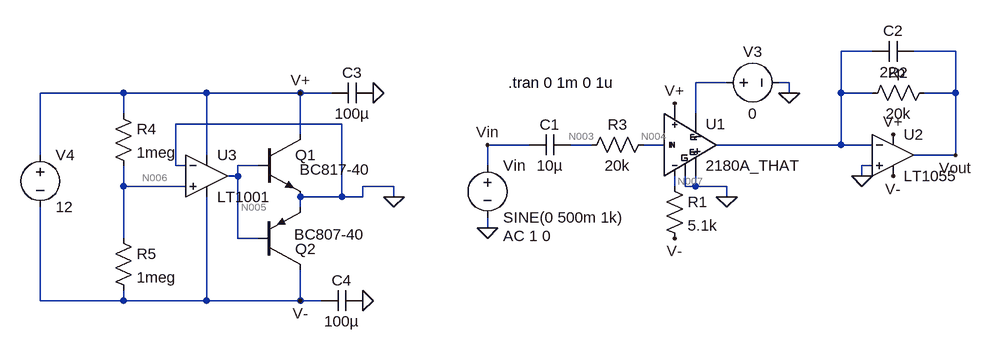
[diagram p0: schematic take2180.asc]
take2180.asc, the LTspice schematic file:
Version 4
SHEET 1 880 680
WIRE 448 48 400 48
WIRE 576 48 512 48
WIRE 224 96 176 96
WIRE 320 96 304 96
WIRE -704 112 -832 112
WIRE -576 112 -704 112
WIRE -432 112 -576 112
WIRE -384 112 -432 112
WIRE 320 112 320 96
WIRE 400 112 400 48
WIRE 448 112 400 112
WIRE 576 112 576 48
WIRE 576 112 528 112
WIRE -704 144 -704 112
WIRE 176 144 176 96
WIRE -368 160 -624 160
WIRE -432 176 -432 112
WIRE -80 192 -144 192
WIRE 16 192 -16 192
WIRE 128 192 96 192
WIRE 400 192 400 112
WIRE 400 192 208 192
WIRE 448 192 400 192
WIRE -832 208 -832 112
WIRE -576 208 -576 112
WIRE 576 208 576 112
WIRE 576 208 512 208
WIRE -624 224 -624 160
WIRE -608 224 -624 224
WIRE -496 224 -528 224
WIRE -144 224 -144 192
WIRE 448 224 432 224
WIRE -528 240 -528 224
WIRE -528 240 -544 240
WIRE 432 240 432 224
WIRE -704 256 -704 224
WIRE -608 256 -704 256
WIRE -288 256 -336 256
WIRE 144 256 144 240
WIRE 160 256 160 240
WIRE 176 256 176 240
WIRE 176 256 160 256
WIRE 224 256 176 256
WIRE -368 272 -368 160
WIRE -368 272 -432 272
WIRE -336 272 -336 256
WIRE -336 272 -368 272
WIRE -288 272 -288 256
WIRE 224 272 224 256
WIRE -432 288 -432 272
WIRE -144 320 -144 304
WIRE -704 336 -704 256
WIRE -528 336 -528 240
WIRE -496 336 -528 336
WIRE -832 432 -832 288
WIRE -704 432 -704 416
WIRE -704 432 -832 432
WIRE -576 432 -576 272
WIRE -576 432 -704 432
WIRE -432 432 -432 384
WIRE -432 432 -576 432
WIRE -400 432 -432 432
FLAG -432 112 V+
FLAG -432 432 V-
FLAG 144 128 V+
FLAG 144 336 V-
FLAG 224 272 0
FLAG 320 112 0
FLAG -144 320 0
FLAG 432 240 0
FLAG 480 176 V+
FLAG 480 240 V-
FLAG -288 272 0
FLAG -336 432 0
FLAG -320 112 0
FLAG -144 192 Vin
FLAG 576 208 Vout
SYMBOL myLib\\THAT2180 160 192 R0
SYMATTR InstName U1
SYMBOL res 128 240 R0
SYMATTR InstName R1
SYMATTR Value 5.1k
SYMBOL voltage 208 96 R270
WINDOW 0 32 56 VTop 2
WINDOW 3 -32 56 VBottom 2
WINDOW 123 0 0 Left 2
WINDOW 39 0 0 Left 2
SYMATTR InstName V3
SYMATTR Value 0
SYMBOL voltage -144 208 R0
WINDOW 123 24 124 Left 2
WINDOW 39 0 0 Left 2
SYMATTR Value2 AC 1 0
SYMATTR InstName Vin
SYMATTR Value SINE(0 500m 1k)
SYMBOL cap -80 208 R270
WINDOW 0 32 32 VTop 2
WINDOW 3 0 32 VBottom 2
SYMATTR InstName C1
SYMATTR Value 10µ
SYMBOL res 0 208 R270
WINDOW 0 32 56 VTop 2
WINDOW 3 0 56 VBottom 2
SYMATTR InstName R3
SYMATTR Value 20k
SYMBOL Opamps\\LT1055 480 144 R0
SYMATTR InstName U2
SYMBOL res 432 128 R270
WINDOW 0 32 56 VTop 2
WINDOW 3 0 56 VBottom 2
SYMATTR InstName R2
SYMATTR Value 20k
SYMBOL cap 448 64 R270
WINDOW 0 32 32 VTop 2
WINDOW 3 0 32 VBottom 2
SYMATTR InstName C2
SYMATTR Value 22p
SYMBOL voltage -832 192 R0
WINDOW 123 0 0 Left 2
WINDOW 39 0 0 Left 2
SYMATTR InstName V4
SYMATTR Value 12
SYMBOL res -720 128 R0
SYMATTR InstName R4
SYMATTR Value 1meg
SYMBOL res -720 320 R0
SYMATTR InstName R5
SYMATTR Value 1meg
SYMBOL npn -496 176 R0
WINDOW 3 63 54 Left 2
SYMATTR Value BC817-40
SYMATTR InstName Q1
SYMBOL pnp -496 384 M180
WINDOW 3 55 54 Left 2
SYMATTR Value BC807-40
SYMATTR InstName Q2
SYMBOL cap -320 96 R90
WINDOW 0 0 32 VBottom 2
WINDOW 3 32 32 VTop 2
SYMATTR InstName C3
SYMATTR Value 100µ
SYMATTR SpiceLine Rser=2
SYMBOL cap -336 416 R90
WINDOW 0 0 32 VBottom 2
WINDOW 3 32 32 VTop 2
SYMATTR InstName C4
SYMATTR Value 100µ
SYMATTR SpiceLine Rser=2
SYMBOL Opamps\\LT1001 -576 176 R0
SYMATTR InstName U3
TEXT -112 96 Left 2 !.tran 0 1m 0 1u

The netlist it stands for:
* take2180.asc
XU1 N004 0 N002 N007 0 V+ N001 2180A_THAT  ; pins In EC+ EC- V- GND V+ OUT
R1 N007 V- 5.1k
V3 N002 0 0
Vin Vin 0 SINE(0 500m 1k) AC 1 0
C1 Vin N003 10µ
R3 N003 N004 20k
XU2 0 N001 V+ V- Vout LT1055  ; pins In+ In- V+ V- OUT
R2 N001 Vout 20k
C2 N001 Vout 22p
V4 V+ V- 12
R4 V+ N006 1meg
R5 N006 V- 1meg
Q1 V+ N005 0 0 BC817-40
Q2 V- N005 0 0 BC807-40
C3 0 V+ 100µ Rser=2
C4 0 V- 100µ Rser=2
XU3 N006 0 V+ V- N005 LT1001  ; pins In+ In- V+ V- OUT
.model NPN NPN
.model PNP PNP
.lib standard.bjt
.tran 0 1m 0 1u
.lib myLib\that.lib
.lib LTC.lib
.backanno
.end

* Results of the author's LTspice run, read from the files saved beside the schematic
* Operating Point, zero values left out:
*   V(v+) = 6 V
*   V(n007) = -2.777 V
*   V(n004) = 2.835 mV
*   V(v-) = -6 V
*   V(n003) = 2.835 mV
*   V(vout) = -140.6 µV
*   V(n006) = 770.1 nV
*   V(n005) = 574.7 mV
*   Ic(Q2) = -6.881 pA
*   Ib(Q2) = 7.47 pA
*   Ic(Q1) = 348.2 µA
*   Ib(Q1) = 812 nA
*   Ie(Q1) = -349 µA
*   I(R5) = 6 µA
*   I(R4) = 6 µA
*   I(R2) = 7.031 nA
*   I(R1) = 632 µA
*   I(V4) = -5.688 mA
*   I(V3) = 99.27 nA
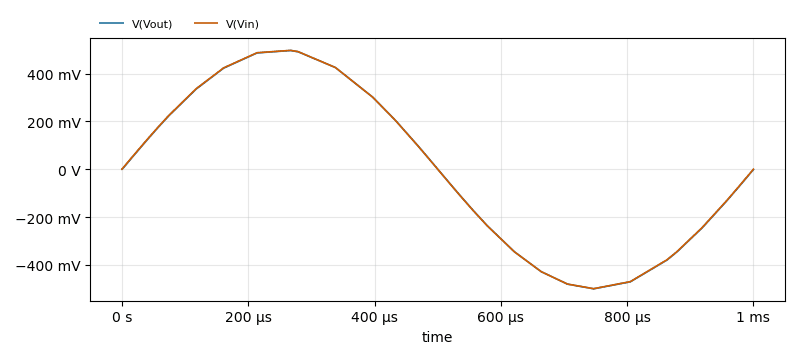
[diagram p1: Transient Analysis of take2180.asc, plotted from the saved traces]
* Transient Analysis, 1 run:
*   V(Vout): min -500.4 mV, max 496.6 mV, average -728.2 µV, rms 352 mV, last -1.648 mV
*   V(Vin): min -499.9 mV, max 497.1 mV, average -177.8 µV, rms 352.1 mV, last 0 V